# Altium project Speaker.PrjPcb
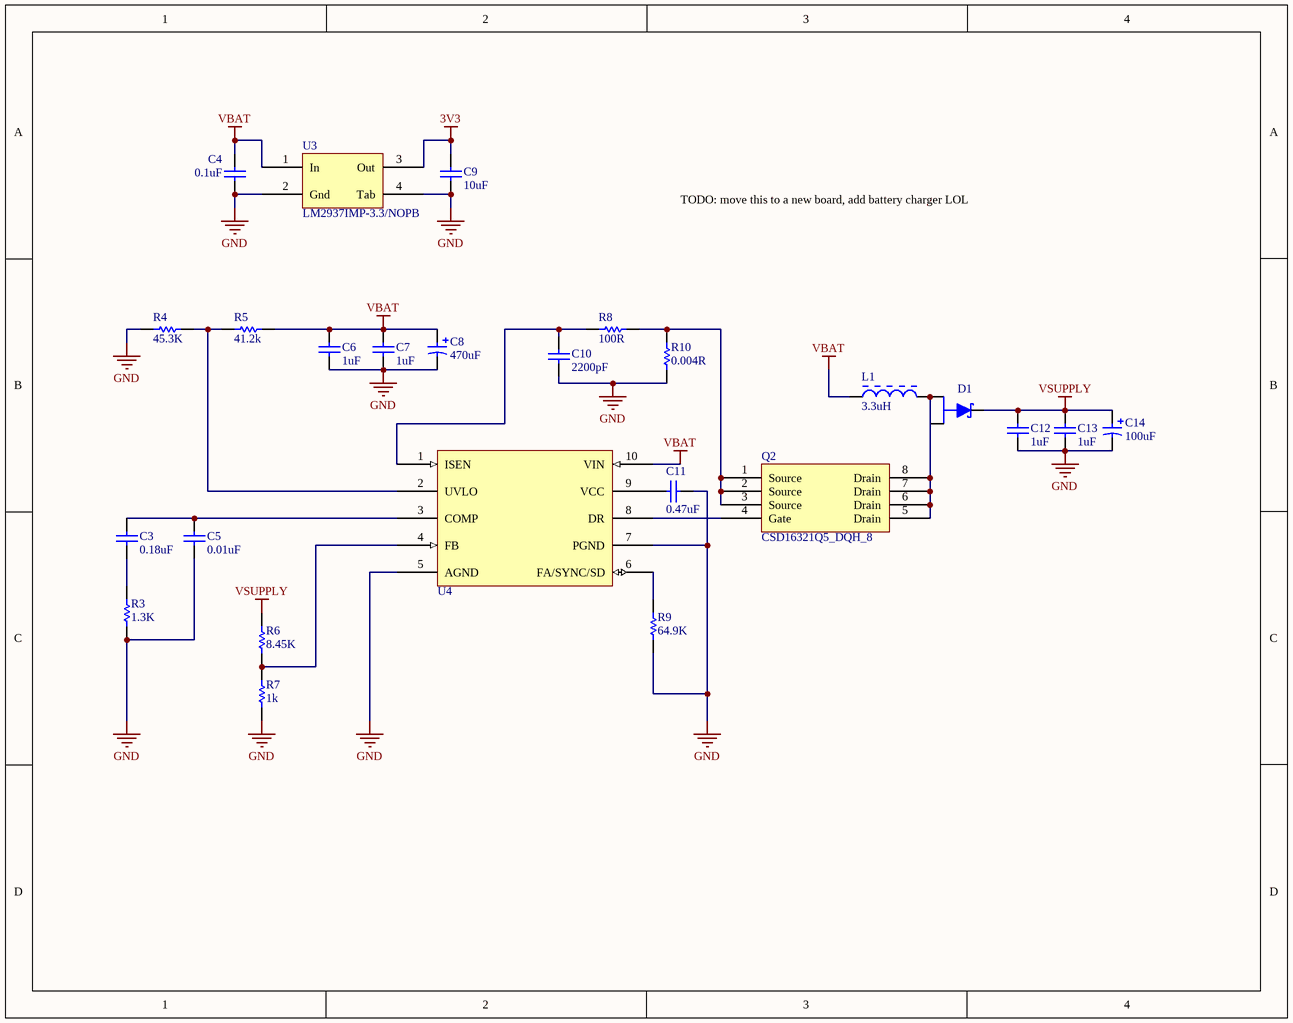
[diagram p0: Power_Supply.SchDoc]
6 sheets, 167 parts. Net scope: global (net labels, ports and power ports of the same name join across sheets).
Board file: Amplifier_Board.PcbDoc
Sheets:
  Power_Supply.SchDoc
  ICs.SchDoc
  Input_Section.SchDoc
  Power_Section.SchDoc
  Filter_Section.SchDoc
  Connectors.SchDoc

## Sheet Power_Supply.SchDoc: Power Supply
size A; Author: Yifei Li; DocumentNumber: 1; SheetNumber: 1; SheetTotal: 6

### Parts
C3  0.18uF  [CAPC1608X09N]
C4  0.1uF  [CAPC1608X09N]
C5  0.01uF  [CAPC1608X09N]
C6  1uF  [CAPC1608X09N]
C7  1uF  [CAPC1608X09N]
C8  470uF  [NICHICON 8x10 CAP]
C9  10uF  [CAPC3216X18N]
C10  2200pF  [CAPC1608X09N]
C11  0.47uF  [CAPC1608X09N]
C12  1uF  [CAPC1608X09N]
C13  1uF  [CAPC1608X09N]
C14  100uF  [PCAP_8x10-ELEC00]
D1  (no value)  [ONSEMI DPAK-3]
L1  3.3uH  [IND_BOURNS_SRP00 - duplicate]
Q2  CSD16321Q5_DQH_8  [DQH8]
R3  1.3K  [RESC1608X06N]
R4  45.3K  [RESC1608X06N]
R5  41.2k  [RESC1608X06N]
R6  8.45K  [RESC1608X06N]
R7  1k  [RESC1608X06N]
R8  100R  [RESC1608X06N]
R9  64.9K  [RESC1608X06N]
R10  0.004R  [RESC6533X09N]
U3  LM2937IMP-3.3/NOPB  [DSO-G3/C6.4]
U4  LM3481  [VSSOP10]  (value not drawn)

### Nets
3V3: C9.2 U3.3(Out)
GND: C4.1 C5.1 C6.1 C7.1 C8.2 C9.1 C10.1 C11.2 C12.1 C13.1 C14.2 R3.1 R4.1 R7.1 R9.1 R10.1 U3.2(Gnd) U3.4(Tab) U4.5(AGND) U4.7(PGND)
VBAT: C4.2 C6.2 C7.2 C8.1 L1.1 R5.2 U3.1(In) U4.10(VIN)
VSUPPLY: C12.2 C13.2 C14.1 D1.4 R6.1
NetC3_1: C3.1 R3.2
NetC3_2: C3.2 C5.2 U4.3(COMP)
NetC10_2: C10.2 R8.1 U4.1(ISEN)
NetC11_1: C11.1 U4.9(VCC)
NetD1_1: D1.1 L1.2 Q2.5(Drain) Q2.6(Drain) Q2.7(Drain) Q2.8(Drain)
NetQ2_1: Q2.1(Source) Q2.2(Source) Q2.3(Source) R8.2 R10.2
NetQ2_4: Q2.4(Gate) U4.8(DR)
NetR4_2: R4.2 R5.1 U4.2(UVLO)
NetR6_2: R6.2 R7.2 U4.4(FB)
NetR9_2: R9.2 U4.6(FA/SYNC/SD)

Not connected (* = marked no-connect by the designer): D1 3

### Notes on the sheet
- TODO: move this to a new board, add battery charger LOL

### Library data of the parts
C3 = CAP CER 0.18uF 0603: Manufacturer: Murata; Voltage: 25V; Rating: X7R; Value: 0.18uF; Digikey Part Number: 490-6431-1-ND; Package: 0603
C4 = CAP CER 0.1uF 0603: Voltage: 100V; Rating: X7R; Tolerance: 10%; Value: 0.1uF; Digikey Part Number: 490-3285-1-ND; Package: 0603
C5 = CAP CER 0.01uF 0603: Manufacturer: Murata; Rating: C0G; Value: 0.01uF; Digikey Part Number: 490-9666-1-ND
C6 C7 C12 C13 = CAP CER 1uF 0603: Voltage: 35V; Value: 1uF; Digikey Part Number: 490-10487-1-ND
C8 = CAP ALUM 470uF SMD: Digikey Part Number: 493-2181-1-ND; Value: 470uF
C9 = CAP CER 10uF 1206: 3V3 filter cap; Voltage: 25V; Rating: X7R; Value: 10uF; Digikey Part Number: 490-6518-1-ND
C10 = CAP CER 2200pF 0603: Manufacturer: Murata; Voltage: 50V; Tolerance: 1%; Rating: C0G; Value: 2200pF; Digikey Part Number: 490-7768-1-ND
C11 = CAP CER 0.47uF 0603: Voltage: 25V; Rating: X7R; Value: 0.47uF; Digikey Part Number: 490-3291-1-ND
C14 = CAP ALUM 100uF SMD: Manufacturer: Nichicon; Voltage: 50V; Digikey Part Number: 493-2226-1-ND; Value: 100uF
D1 = MBRD835LT4G: SHOTTKEY 35V 8A; Type: SCHOT; Configuration: Single; Footprint: TO-252-3; Voltage: 35V; Current: 8A; Digikey Part Number: MBRD835LT4GOSCT-ND
L1 = IND 3.3µH 7A SMD: Digikey Part Number: SRP7030-3R3FMCT-ND; Value: 3.3uH
Q2 = CSD16321Q5_DQH_8: Manufacturer: Texas Instruments; INDUSTRY_STD_PKG_TYPE: SON; FAMILY_NAME: N-Channel MOSFET Transistors; PIN_COUNT: 8; PACKAGE_DESIGNATOR: DQH; Type: DEV; Datasheet URL: http://www.ti.com/lit/gpn/CSD16321Q5; GENERIC_PART_NUMBER: CSD16321Q5; RefDes: RefDes; Value: Value; Digikey Part Number: 296-25643-1-ND
R3 = RES 1.3K 0603: Manufacturer: Vishay Dale; Tolerance: 1%; Power: 0.1W; Type: RES; Footprint: 0603; Digikey Part Number: 541-1.30KHCT-ND; Value: 1.3K
R4 = RES 45.3K 0603: Manufacturer: Vishay Dale; Tolerance: 1%; Power: 0.1W; Type: RES; Footprint: 0603; Digikey Part Number: 541-45.3KHCT-ND; Value: 45.3K
R5 = RES 41.2K 0603: Manufacturer: Vishay Dale; Tolerance: 1%; Power: 0.1W; Type: RES; Footprint: 0603; Digikey Part Number: 311-41.2KHRCT-ND; Value: 41.2k
R6 = RES 8.45K 0603: Manufacturer: Vishay Dale; Tolerance: 1%; Power: 0.1W; Type: RES; Footprint: 0603; Digikey Part Number: 541-8.45KHCT-ND; Value: 8.45K
R7 = RES 1K 0603: Manufacturer: Panasonic; Manufacturer Part Number: ERJ-PA3F1001V; Tolerance: 1%; Power: 0.25W; Type: RES; Footprint: 0603; Temperature: 155dC; Digikey Part Number: P1.0KBYCT-ND; Value: 1k
R8 = RES 100R 0603: Tolerance: 1%; Power: 0.25W; Type: RES; Footprint: 0603; Digikey Part Number: 541-100SACT-ND; Value: 100R
R9 = RES 64.9K 0603: Manufacturer: Vishay Dale; Tolerance: 1%; Power: 0.1W; Type: RES; Footprint: 0603; Digikey Part Number: 541-64.9KHCT-ND; Value: 64.9K
R10 = RES 0.004R 2512: Manufacturer: Panasonic; Tolerance: 1%; Power: 1W; Type: RES; Footprint: 2512; Digikey Part Number: P4.0MCT-ND; Value: 0.004R
U4 = LM3481: IC REG CTRLR MULT TOP 10MSOP; Digikey Part Number: LM3481MM/NOPBCT-ND
U3 = LM2937IMP-3.3/NOPB: Digikey Part Number: LM2937IMP-3.3/NOPBCT-ND

## Sheet ICs.SchDoc
size A4; DocumentNumber: 2; SheetNumber: 2; SheetTotal: 6
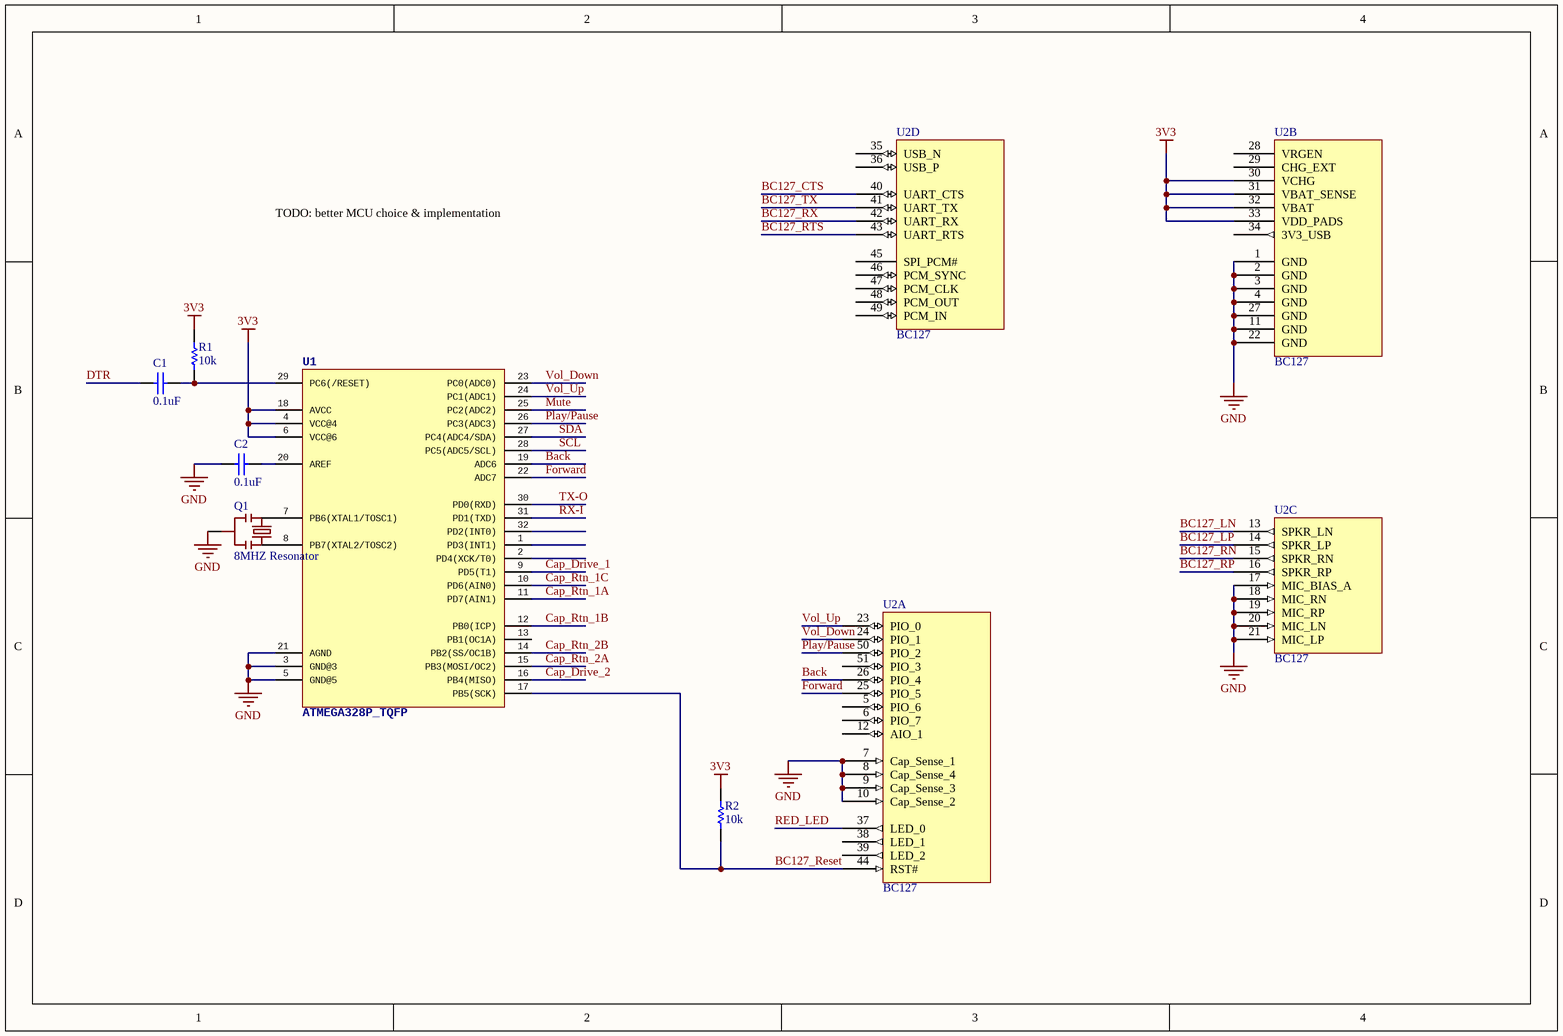
[diagram p1: ICs.SchDoc]

### Parts
C1  0.1uF  [CAPC1608X09N]
C2  0.1uF  [CAPC1608X09N]
Q1  8MHZ Resonator  [MURATA CSTCE8M00G52Z-R0]
R1  10k  [RESC1608X06N]
R2  10k  [RESC1608X06N]
U1  ATMEGA328P_TQFP  [TQFP32-08]
U2  BC127  [BC127 - No Keepout]  (parts A,B,C,D of 4)

### Nets
3V3: R1.2 R2.2 U1.4(VCC@4) U1.6(VCC@6) U1.18(AVCC) U2.30(VCHG) U2.31(VBAT_SENSE) U2.32(VBAT) U2.33(VDD_PADS)
GND: C2.1 Q1.2(GND) U1.3(GND@3) U1.5(GND@5) U1.21(AGND) U2.1(GND) U2.2(GND) U2.3(GND) U2.4(GND) U2.7(Cap_Sense_1) U2.8(Cap_Sense_4) U2.9(Cap_Sense_3) U2.10(Cap_Sense_2) U2.11(GND) U2.17(MIC_BIAS_A) U2.18(MIC_RN) U2.19(MIC_RP) U2.20(MIC_LN) U2.21(MIC_LP) U2.22(GND) U2.27(GND)
Back: U1.19(ADC6) U2.26(PIO_4)
BC127_CTS: U2.40(UART_CTS)
BC127_LN: U2.13(SPKR_LN)
BC127_LP: U2.14(SPKR_LP)
BC127_Reset: R2.1 U1.17(PB5(SCK)) U2.44(RST#)
BC127_RN: U2.15(SPKR_RN)
BC127_RP: U2.16(SPKR_RP)
BC127_RTS: U2.43(UART_RTS)
BC127_RX: U2.42(UART_RX)
BC127_TX: U2.41(UART_TX)
Cap_Drive_1: U1.9(PD5(T1))
Cap_Drive_2: U1.16(PB4(MISO))
Cap_Rtn_1A: U1.11(PD7(AIN1))
Cap_Rtn_1B: U1.12(PB0(ICP))
Cap_Rtn_1C: U1.10(PD6(AIN0))
Cap_Rtn_2A: U1.15(PB3(MOSI/OC2))
Cap_Rtn_2B: U1.14(PB2(SS/OC1B))
DTR: C1.1
Forward: U1.22(ADC7) U2.25(PIO_5)
Mute: U1.25(PC2(ADC2))
Play/Pause: U1.26(PC3(ADC3)) U2.50(PIO_2)
RED_LED: U2.37(LED_0)
RX-I: U1.31(PD1(TXD))
SCL: U1.28(PC5(ADC5/SCL))
SDA: U1.27(PC4(ADC4/SDA))
TX-O: U1.30(PD0(RXD))
Vol_Down: U1.23(PC0(ADC0)) U2.24(PIO_1)
Vol_Up: U1.24(PC1(ADC1)) U2.23(PIO_0)
NetC1_2: C1.2 R1.1 U1.29(PC6(/RESET))
NetC2_2: C2.2 U1.20(AREF)
NetQ1_1: Q1.1 U1.7(PB6(XTAL1/TOSC1))
NetQ1_3: Q1.3 U1.8(PB7(XTAL2/TOSC2))

Not connected (* = marked no-connect by the designer): U1 1(PD3(INT1)) 2(PD4(XCK/T0)) 13(PB1(OC1A)) 32(PD2(INT0)); U2 5(PIO_6) 6(PIO_7) 12(AIO_1) 28(VRGEN) 29(CHG_EXT) 34(3V3_USB) 35(USB_N) 36(USB_P) 38(LED_1) 39(LED_2) 45(SPI_PCM#) 46(PCM_SYNC) 47(PCM_CLK) 48(PCM_OUT) 49(PCM_IN) 51(PIO_3)

### Notes on the sheet
- TODO: better MCU choice & implementation

### Library data of the parts
C1 C2 = CAP CER 0.1uF 0603: as C4 on sheet Power_Supply; Value: 0.1uF; Digikey Part Number: 490-3285-1-ND; Package: 0603
Q1 = RESONATOR 8MHZ: Digikey Part Number: 490-5995-1-ND
R1 R2 = RES 10K 0603: Manufacturer: Yageo; Manufacturer Part Number: RC0603FR-0710KL; Tolerance: 1%; Power: 0.1W; Type: RES; Footprint: 0603; Temperature: 155dC; Digikey Part Number: 311-10.0KHRCT-ND; Value: 10k
U1 = ATMEGA328P_TQFP: PROD_ID: IC-09069; Digikey Part Number: ATMEGA328P-AURCT-ND

## Sheet Input_Section.SchDoc
size A4; DocumentNumber: 3; SheetNumber: 3; SheetTotal: 6
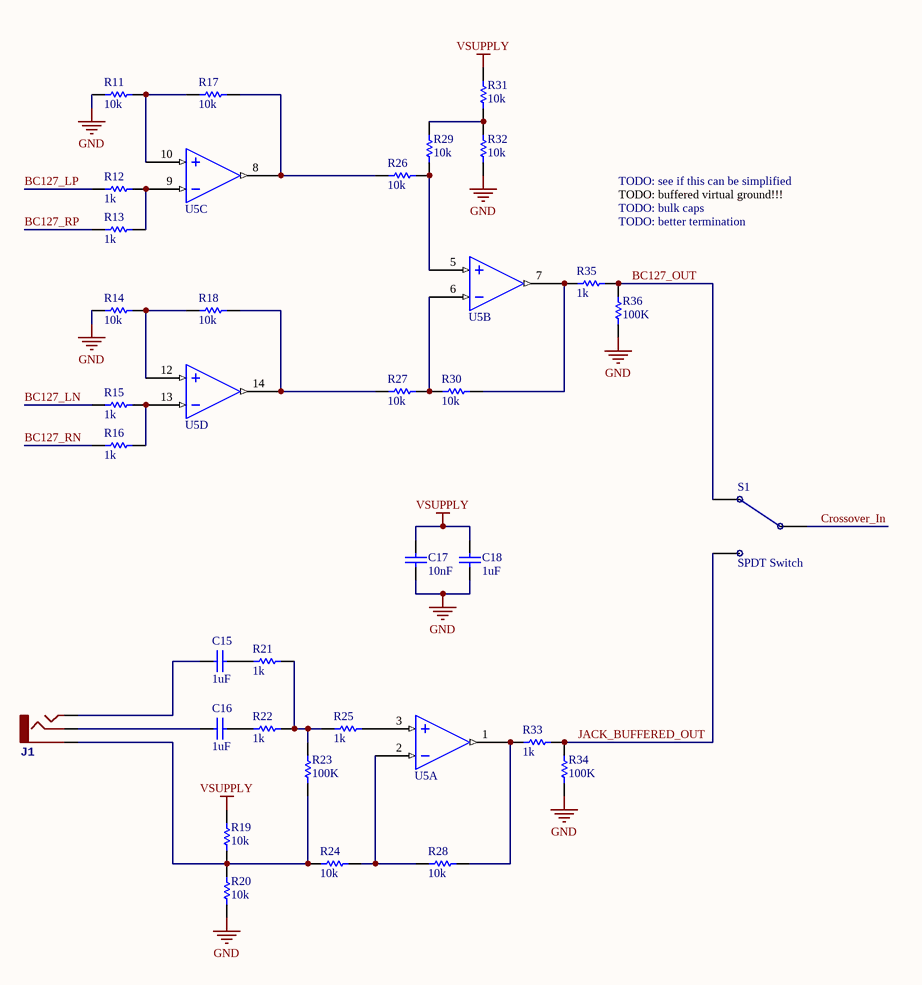
[diagram p2: Input_Section.SchDoc]

### Parts
C15  1uF  [CAP Radial 5mm]
C16  1uF  [CAP Radial 5mm]
C17  10nF  [CAPC1608X09N]
C18  1uF  [CAPC1608X09N]
J1  3.5mm Audio Jack  [70543-0002]  (value not drawn)
R11  10k  [RESC1608X06N]
R12  1k  [RESC1608X06N]
R13  1k  [RESC1608X06N]
R14  10k  [RESC1608X06N]
R15  1k  [RESC1608X06N]
R16  1k  [RESC1608X06N]
R17  10k  [RESC1608X06N]
R18  10k  [RESC1608X06N]
R19  10k  [RESC1608X06N]
R20  10k  [RESC1608X06N]
R21  1k  [RESC1608X06N]
R22  1k  [RESC1608X06N]
R23  100K  [RESC1608X06N]
R24  10k  [RESC1608X06N]
R25  1k  [RESC1608X06N]
R26  10k  [RESC1608X06N]
R27  10k  [RESC1608X06N]
R28  10k  [RESC1608X06N]
R29  10k  [RESC1608X06N]
R30  10k  [RESC1608X06N]
R31  10k  [RESC1608X06N]
R32  10k  [RESC1608X06N]
R33  1k  [RESC1608X06N]
R34  100K  [RESC1608X06N]
R35  1k  [RESC1608X06N]
R36  100K  [RESC1608X06N]
S1  SPDT Switch  [70543-0002]
U5  OPA4134UA  [SOIC127P600X175-14N]  (value not drawn)  (parts A,B,C,D of 4)

### Nets
GND: C17.1 C18.2 R11.1 R14.1 R20.1 R32.1 R34.1 R36.1 U5.11(V-)
VSUPPLY: C17.2 C18.1 R19.2 R31.2 U5.4(V+)
BC127_LN: R15.1
BC127_LP: R12.1
BC127_OUT: R35.2 R36.2 S1.2
BC127_RN: R16.1
BC127_RP: R13.1
Crossover_In: S1.1
JACK_BUFFERED_OUT: R33.2 R34.2 S1.3
NetC15_1: C15.1 J1.3(LEFT)
NetC15_2: C15.2 R21.1
NetC16_1: C16.1 J1.2(RIGHT)
NetC16_2: C16.2 R22.1
NetJ1_1: J1.1(SLEEVE) R19.1 R20.2 R23.1 R24.1
NetR11_2: R11.2 R17.1 U5.10(+In_C)
NetR12_2: R12.2 R13.2 U5.9(-In_C)
NetR14_2: R14.2 R18.1 U5.12(+In_D)
NetR15_2: R15.2 R16.2 U5.13(-In_D)
NetR17_2: R17.2 R26.1 U5.8(Out_C)
NetR18_2: R18.2 R27.1 U5.14(Out_D)
NetR21_2: R21.2 R22.2 R23.2 R25.1
NetR24_2: R24.2 R28.1 U5.2(-In_A)
NetR25_2: R25.2 U5.3(+In_A)
NetR26_2: R26.2 R29.1 U5.5(+In_B)
NetR27_2: R27.2 R30.2 U5.6(-In_B)
NetR28_2: R28.2 R33.1 U5.1(Out_A)
NetR29_2: R29.2 R31.1 R32.2
NetR30_1: R30.1 R35.1 U5.7(Out_B)

### Notes on the sheet
- TODO: see if this can be simplified
- TODO: buffered virtual ground!!!
- TODO: bulk caps
- TODO: better termination

### Library data of the parts
C15 C16 = CAP 1uF Radial 5mm: Audio coupling cap; Manufacturer: EPCOS (TDK); Manufacturer P/N: B32529C105J; Voltage: 63V; Value: 1uF; Digikey Part Number: 495-1119-ND
C17 = CAP CER 10nF 0603: Bypass caps; Manufacturer: Murata; Value: 10nF; Digikey Part Number: 490-9666-1-ND
C18 = CAP CER 1uF 0603: Voltage: 35V; Value: 1uF; Digikey Part Number: 490-10487-1-ND
R11 R14 R17-R20 R24 R26-R32 = RES 10K 0603: as R1 on sheet ICs; Type: RES; Footprint: 0603; Temperature: 155dC; Digikey Part Number: 311-10.0KHRCT-ND; Value: 10k
R12 R13 R15 R16 R21 R22 R25 R33 R35 = RES 1K 0603: as R7 on sheet Power_Supply; Type: RES; Footprint: 0603; Temperature: 155dC; Digikey Part Number: P1.0KBYCT-ND; Value: 1k
R23 R34 R36 = RES 100K 0603: Tolerance: 1%; Power: 0.1W; Footprint: 0603; Value: 100K; Digikey Part Number: 311-100KHRCT-ND
U5 = OPA4134UA: Quad OPAx134 Operational Amplifier; Digikey Part Number: 296-26284-1-ND

## Sheet Power_Section.SchDoc
size A4; DocumentNumber: 4; SheetNumber: 4; SheetTotal: 6
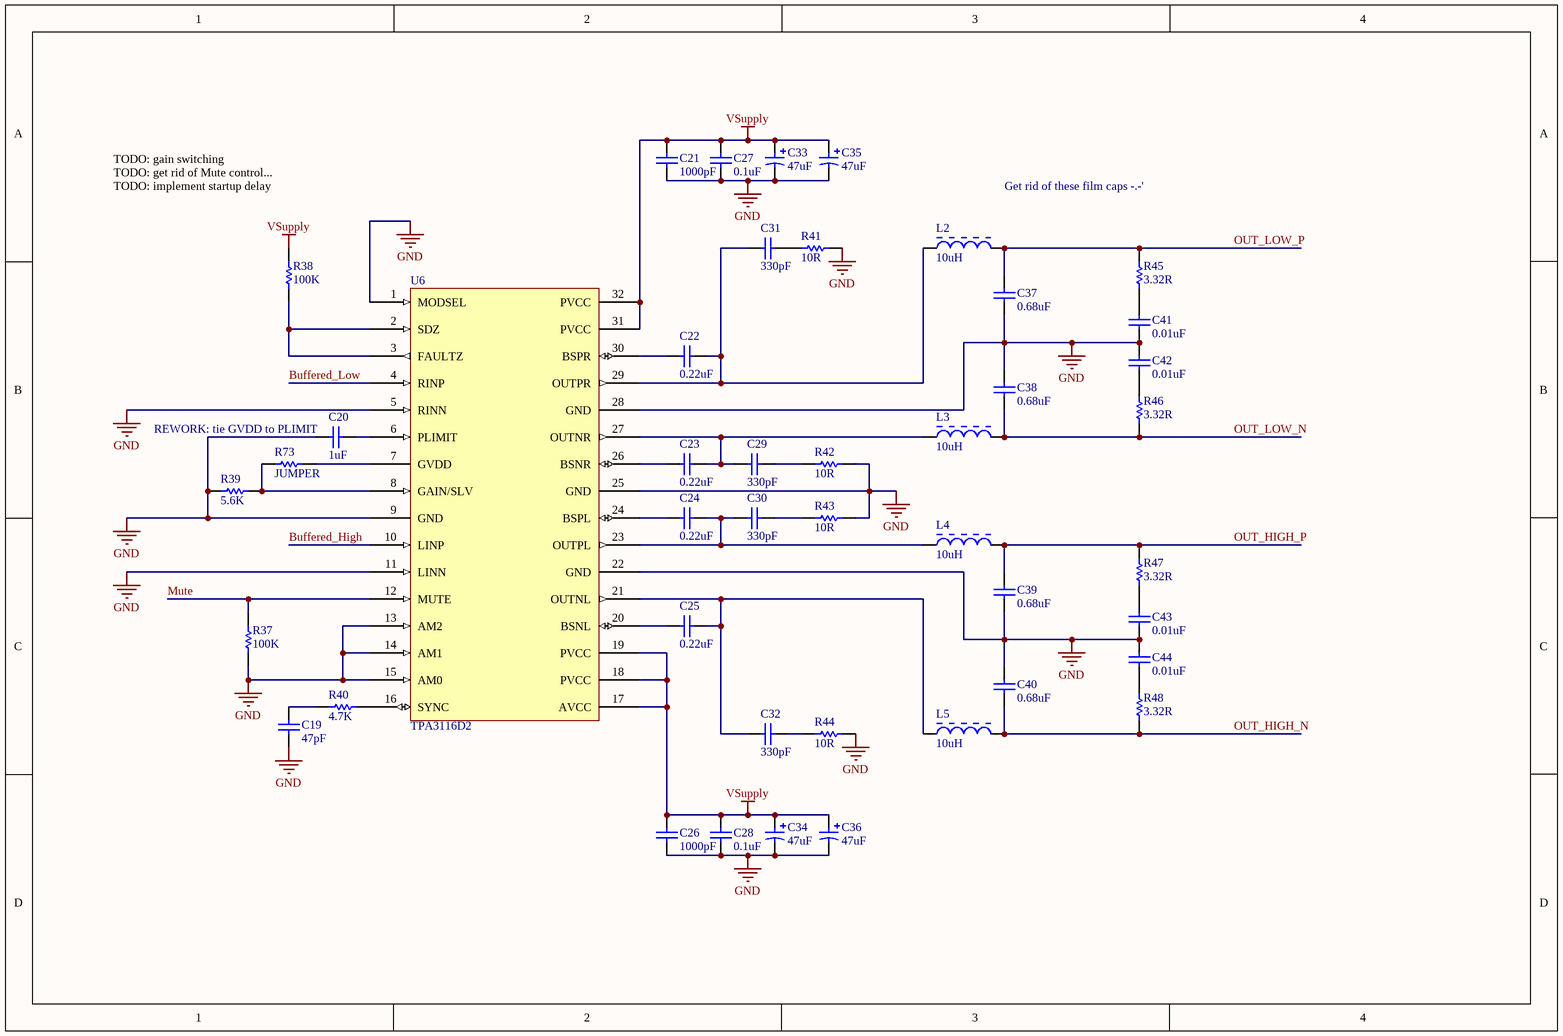
[diagram p3: Power_Section.SchDoc]

### Parts
C19  47pF  [CAPC1608X09N]
C20  1uF  [CAPC1608X09N]
C21  1000pF  [CAPC1608X09N]
C22  0.22uF  [CAPC1608X09N]
C23  0.22uF  [CAPC1608X09N]
C24  0.22uF  [CAPC1608X09N]
C25  0.22uF  [CAPC1608X09N]
C26  1000pF  [CAPC1608X09N]
C27  0.1uF  [CAPC1608X09N]
C28  0.1uF  [CAPC1608X09N]
C29  330pF  [CAPC1608X09N]
C30  330pF  [CAPC1608X09N]
C31  330pF  [CAPC1608X09N]
C32  330pF  [CAPC1608X09N]
C33  47uF  [CAP_EEFK_D]
C34  47uF  [CAP_EEFK_D]
C35  47uF  [CAP_EEFK_D]
C36  47uF  [CAP_EEFK_D]
C37  0.68uF  [CAP Radial 5mm]
C38  0.68uF  [CAP Radial 5mm]
C39  0.68uF  [CAP Radial 5mm]
C40  0.68uF  [CAP Radial 5mm]
C41  0.01uF  [CAPC1608X09N]
C42  0.01uF  [CAPC1608X09N]
C43  0.01uF  [CAPC1608X09N]
C44  0.01uF  [CAPC1608X09N]
L2  10uH  [IND_BOURNS_SRN10]
L3  10uH  [IND_BOURNS_SRN10]
L4  10uH  [IND_BOURNS_SRN10]
L5  10uH  [IND_BOURNS_SRN10]
R37  100K  [RESC1608X06N]
R38  100K  [RESC1608X06N]
R39  5.6K  [RESC1608X06N]
R40  4.7K  [RESC1608X06N]
R41  10R  [RESC2012X06N]
R42  10R  [RESC2012X06N]
R43  10R  [RESC2012X06N]
R44  10R  [RESC2012X06N]
R45  3.32R  [RESC1608X06N]
R46  3.32R  [RESC1608X06N]
R47  3.32R  [RESC1608X06N]
R48  3.32R  [RESC1608X06N]
R73  JUMPER  [RESC1608X06N]
U6  TPA3116D2  [DAP0032A]

### Nets
GND: C19.1 C20.1 C21.1 C26.1 C27.1 C28.1 C33.2 C34.2 C35.2 C36.2 C37.1 C38.2 C39.1 C40.2 C41.1 C42.2 C43.1 C44.2 R37.1 R39.2 R41.2 R42.2 R43.2 R44.2 U6.1(MODSEL) U6.5(RINN) U6.9(GND) U6.11(LINN) U6.13(AM2) U6.14(AM1) U6.15(AM0) U6.22(GND) U6.25(GND) U6.28(GND) U6.33(POWERPAD)
VSUPPLY: C21.2 C26.2 C27.2 C28.2 C33.1 C34.1 C35.1 C36.1 R38.2 U6.17(AVCC) U6.18(PVCC) U6.19(PVCC) U6.31(PVCC) U6.32(PVCC)
Buffered_High: U6.10(LINP)
Buffered_Low: U6.4(RINP)
Mute: R37.2 U6.12(MUTE)
OUT_HIGH_N: C40.1 L5.2 R48.1
OUT_HIGH_P: C39.2 L4.2 R47.2
OUT_LOW_N: C38.1 L3.2 R46.1
OUT_LOW_P: C37.2 L2.2 R45.2
NetC19_2: C19.2 R40.1
NetC20_2: C20.2 U6.6(PLIMIT)
NetC22_1: C22.1 U6.30(BSPR)
NetC22_2: C22.2 C31.1 L2.1 U6.29(OUTPR)
NetC23_1: C23.1 U6.26(BSNR)
NetC23_2: C23.2 C29.1 L3.1 U6.27(OUTNR)
NetC24_1: C24.1 U6.24(BSPL)
NetC24_2: C24.2 C30.1 L4.1 U6.23(OUTPL)
NetC25_1: C25.1 U6.20(BSNL)
NetC25_2: C25.2 C32.1 L5.1 U6.21(OUTNL)
NetC29_2: C29.2 R42.1
NetC30_2: C30.2 R43.1
NetC31_2: C31.2 R41.1
NetC32_2: C32.2 R44.1
NetC41_2: C41.2 R45.1
NetC42_1: C42.1 R46.2
NetC43_2: C43.2 R47.1
NetC44_1: C44.1 R48.2
NetR38_1: R38.1 U6.2(SDZ) U6.3(FAULTZ)
NetR39_1: R39.1 R73.1 U6.8(GAIN/SLV)
NetR40_2: R40.2 U6.16(SYNC)
NetR73_2: R73.2 U6.7(GVDD)

### Notes on the sheet
- TODO: gain switching
- TODO: get rid of Mute control...
- TODO: implement startup delay
- Get rid of these film caps -.-'
- REWORK: tie GVDD to PLIMIT

### Library data of the parts
C19 = CAP CER 47pF 0603: Rating: C0G; Voltage: 50V; Value: 47pF; Digikey Part Number: 490-1419-1-ND
C20 = CAP CER 1uF 0603: Voltage: 35V; Value: 1uF; Digikey Part Number: 490-10487-1-ND
C21 C26 = CAP CER 1000pF 0603: Manufacturer: Murata; Rating: C0G; Voltage: 50V; Value: 1000pF; Digikey Part Number: 490-1451-1-ND
C22-C25 = CAP CER 0.22uF 0603: Manufacturer: Murata; Voltage: 50V; Rating: X7R; Value: 0.22uF; Digikey Part Number: 490-5402-1-ND
C27 C28 = CAP CER 0.1uF 0603: as C4 on sheet Power_Supply; Value: 0.1uF; Digikey Part Number: 490-3285-1-ND; Package: 0603
C29-C32 = CAP CER 330pF 0603: Manufacturer: Murata; Rating: C0G; Voltage: 50V; Value: 330pF; Digikey Part Number: 490-1439-1-ND
C33-C36 = CAP ALUM 47uF SMD: Manufacturer: Panasonic; Voltage: 35V; Digikey Part Number: PCE3842CT-ND; Value: 47uF
C37-C40 = CAP 0.68uF Radial 5mm: Output Cap; Manufacturer: EPCOS (TDK); Voltage: 63V; Value: 0.68uF; Digikey Part Number: 495-1114-ND
C41-C44 = CAP CER 0.01uF 0603: Manufacturer: Murata; Rating: C0G; Value: 0.01uF; Digikey Part Number: 490-9666-1-ND
L2-L5 = IND 10uH 5A SMD: Digikey Part Number: SRN1060-100MCT-ND; Value: 10uH
R37 R38 = RES 100K 0603: Tolerance: 1%; Power: 0.1W; Footprint: 0603; Value: 100K; Digikey Part Number: 311-100KHRCT-ND
R39 = RES 5.6K 0603: Tolerance: 1%; Type: RES; Footprint: 0603; Value: 5.6K; Digikey Part Number: 311-5.60KHRCT-ND
R40 = RES 4.7K 0603: Tolerance: 1%; Type: RES; Footprint: 0603; Value: 4.7K; Digikey Part Number: 311-4.70KHRCT-ND
R41-R44 = RES 10R 0805: Tolerance: 1%; Power: 0.25W; Type: RES; Footprint: 0805; Digikey Part Number: RNCP0805FTD10R0CT-ND; Value: 10R
R45-R48 = RES 3.32R 0603: Tolerance: 1%; Power: 0.1W; Type: RES; Footprint: 0603; Digikey Part Number: 311-3.32HRCT-ND; Value: 3.32R
R73 = RES JUMPER 0603: Tolerance: 1%; Power: 0.25W; Type: RES; Footprint: 0603; Temperature: 155dC; Value: JUMPER; Digikey Part Number: 311-0.0GRCT-ND
U6 = TPA3116D2: Digikey Part Number: 296-39337-1-ND

## Sheet Filter_Section.SchDoc
size A3; DocumentNumber: 5; SheetNumber: 5; SheetTotal: 6
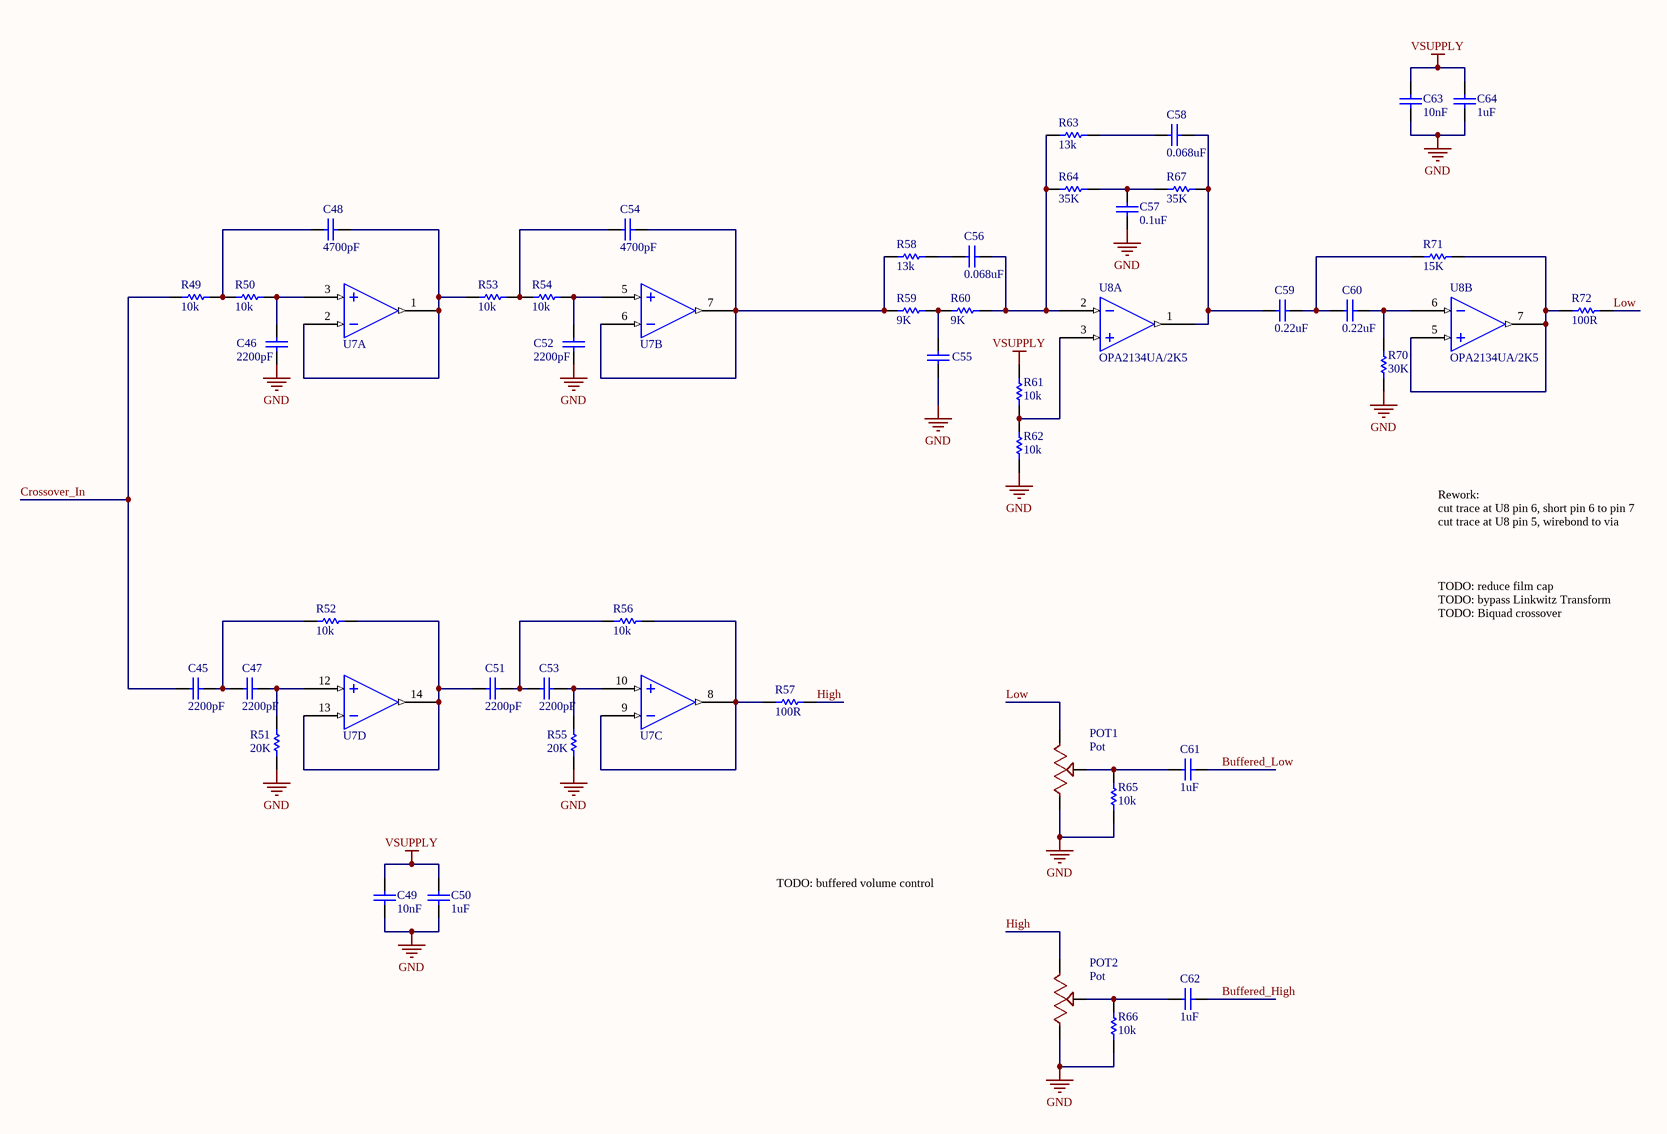
[diagram p4: Filter_Section.SchDoc]

### Parts
C45  2200pF  [CAPC1608X09N]
C46  2200pF  [CAPC1608X09N]
C47  2200pF  [CAPC1608X09N]
C48  4700pF  [CAPC1608X09N]
C49  10nF  [CAPC1608X09N]
C50  1uF  [CAPC1608X09N]
C51  2200pF  [CAPC1608X09N]
C52  2200pF  [CAPC1608X09N]
C53  2200pF  [CAPC1608X09N]
C54  4700pF  [CAPC1608X09N]
C55  0.39uF  [CAP Radial 5mm]  (value not drawn)
C56  0.068uF  [CAPC3216X18N]
C57  0.1uF  [CAPC3216X18N]
C58  0.068uF  [CAPC3216X18N]
C59  0.22uF  [CAP Radial 5mm]
C60  0.22uF  [CAP Radial 5mm]
C61  1uF  [CAP Radial 5mm]
C62  1uF  [CAP Radial 5mm]
C63  10nF  [CAPC1608X09N]
C64  1uF  [CAPC1608X09N]
POT1  Pot  [70543-0002]
POT2  Pot  [70543-0002]
R49  10k  [RESC1608X06N]
R50  10k  [RESC1608X06N]
R51  20K  [RESC1608X06N]
R52  10k  [RESC1608X06N]
R53  10k  [RESC1608X06N]
R54  10k  [RESC1608X06N]
R55  20K  [RESC1608X06N]
R56  10k  [RESC1608X06N]
R57  100R  [RESC1608X06N]
R58  13k  [RESC1608X06N]
R59  9K  [RESC1608X06N]
R60  9K  [RESC1608X06N]
R61  10k  [RESC1608X06N]
R62  10k  [RESC1608X06N]
R63  13k  [RESC1608X06N]
R64  35K  [RESC1608X06N]
R65  10k  [RESC1608X06N]
R66  10k  [RESC1608X06N]
R67  35K  [RESC1608X06N]
R70  30K  [RESC1608X06N]
R71  15K  [RESC1608X06N]
R72  100R  [RESC1608X06N]
U7  OPA4134UA  [SOIC127P600X175-14N]  (value not drawn)  (parts A,B,C,D of 4)
U8  OPA2134UA/2K5  [SOIC127P600X175-8N]  (parts A,B of 2)

### Nets
GND: C46.1 C49.1 C50.1 C52.1 C55.1 C57.2 C63.1 C64.1 POT1.3(B) POT2.3(B) R51.1 R55.2 R62.1 R65.1 R66.1 R70.1 U7.11(V-) U8.4(V-)
VSUPPLY: C49.2 C50.2 C63.2 C64.2 R61.2 U7.4(V+) U8.8(V+)
Buffered_High: C62.2
Buffered_Low: C61.2
Crossover_In: C45.1 R49.1
High: POT2.1(A) R57.2
Low: POT1.1(A) R72.2
NetC45_2: C45.2 C47.1 R52.1
NetC46_2: C46.2 R50.2 U7.3(+In_A)
NetC47_2: C47.2 R51.2 U7.12(+In_D)
NetC48_1: C48.1 R49.2 R50.1
NetC48_2: C48.2 R53.1 U7.1(Out_A) U7.2(-In_A)
NetC51_1: C51.1 R52.2 U7.13(-In_D) U7.14(Out_D)
NetC51_2: C51.2 C53.1 R56.1
NetC52_2: C52.2 R54.2 U7.5(+In_B)
NetC53_2: C53.2 R55.1 U7.10(+In_C)
NetC54_1: C54.1 R53.2 R54.1
NetC54_2: C54.2 R58.1 R59.1 U7.6(-In_B) U7.7(Out_B)
NetC55_2: C55.2 R59.2 R60.1
NetC56_1: C56.1 R58.2
NetC56_2: C56.2 R60.2 R63.1 R64.1 U8.2(-In_A)
NetC57_1: C57.1 R64.2 R67.1
NetC58_1: C58.1 R63.2
NetC58_2: C58.2 C59.1 R67.2 U8.1(Out_A)
NetC59_2: C59.2 C60.1 R71.1
NetC60_2: C60.2 R70.2 U8.6(-In_B)
NetC61_1: C61.1 POT1.2(W) R65.2
NetC62_1: C62.1 POT2.2(W) R66.2
NetR56_2: R56.2 R57.1 U7.8(Out_C) U7.9(-In_C)
NetR61_1: R61.1 R62.2 U8.3(+In_A)
NetR71_2: R71.2 R72.1 U8.5(+In_B) U8.7(Out_B)

### Notes on the sheet
- Rework:
  cut trace at U8 pin 6, short pin 6 to pin 7
  cut trace at U8 pin 5, wirebond to via
- TODO: reduce film cap
- TODO: bypass Linkwitz Transform
- TODO: Biquad crossover
- TODO: buffered volume control

### Library data of the parts
C45-C47 C51-C53 = CAP CER 2200pF 0603: as C10 on sheet Power_Supply; Value: 2200pF; Digikey Part Number: 490-7768-1-ND
C48 C54 = CAP CER 4700pF 0603: Manufacturer: TDK; Voltage: 100V; Tolerance: 5%; Rating: C0G; Value: 4700pF; Digikey Part Number: 445-172684-1-ND
C49 C63 = CAP CER 10nF 0603: Bypass caps; Manufacturer: Murata; Value: 10nF; Digikey Part Number: 490-9666-1-ND
C50 C64 = CAP CER 1uF 0603: Voltage: 35V; Value: 1uF; Digikey Part Number: 490-10487-1-ND
C55 = CAP 0.39uF Radial 5mm: Film cap in LT; Manufacturer: EPCOS (TDK); Manufacturer P/N: B32529C105J; Voltage: 63V; Value: 0.39uF; Digikey Part Number: 495-4846-1-ND
C56 C58 = CAP CER 0.068uF 1206: Voltage: 100V; Rating: C0G; Tolerance: 5%; Value: 0.068uF; Digikey Part Number: 445-172693-1-ND; Package: 1206
C57 = CAP CER 0.1uF 1206: LT capacitor; Voltage: 100V; Rating: C0G; Tolerance: 5%; Value: 0.1uF; Digikey Part Number: 445-172694-1-ND; Package: 1206
C59 C60 = CAP 0.22uF Radial 5mm: Film cap in crossover; Manufacturer: EPCOS (TDK); Voltage: 100V; Value: 0.22uF; Digikey Part Number: 495-4985-1-ND
C61 C62 = CAP 1uF Radial 5mm: as C15 on sheet Input_Section; Value: 1uF; Digikey Part Number: 495-1119-ND
R49 R50 R52-R54 R56 R61 R62 R65 R66 = RES 10K 0603: as R1 on sheet ICs; Type: RES; Footprint: 0603; Temperature: 155dC; Digikey Part Number: 311-10.0KHRCT-ND; Value: 10k
R51 R55 = RES 20K 0603: Tolerance: 1%; Power: 0.1W; Footprint: 0603; Value: 20K; Digikey Part Number: 311-20.0KHRCT-ND
R57 R72 = RES 100R 0603: Tolerance: 1%; Power: 0.25W; Type: RES; Footprint: 0603; Digikey Part Number: 541-100SACT-ND; Value: 100R
R58 R63 = RES 13K 0603: Tolerance: 1%; Type: RES; Footprint: 0603; Value: 13k; Digikey Part Number: 311-13.0KHRCT-ND
R59 R60 = RES 9K 0603: Tolerance: 1%; Type: RES; Footprint: 0603; Value: 9K; Digikey Part Number: 311-9.09KHRCT-ND
R64 R67 = RES 35K 0603: Tolerance: 1%; Type: RES; Footprint: 0603; Value: 35K; Digikey Part Number: 311-34.8KHRCT-ND
R70 = RES 30K 0603: Tolerance: 1%; Type: RES; Footprint: 0603; Value: 30K; Digikey Part Number: 311-30.0KHRCT-ND
R71 = RES 15K 0603: Tolerance: 1%; Type: RES; Footprint: 0603; Value: 15K; Digikey Part Number: 311-15.0KHRCT-ND
U7 = OPA4134UA: Quad OPAx134 Operational Amplifier; Digikey Part Number: 296-26284-1-ND
U8 = OPA2134UA/2K5: Digikey Part Number: 296-22024-1-ND

## Sheet Connectors.SchDoc
size A4; DocumentNumber: 6; SheetNumber: 6; SheetTotal: 6
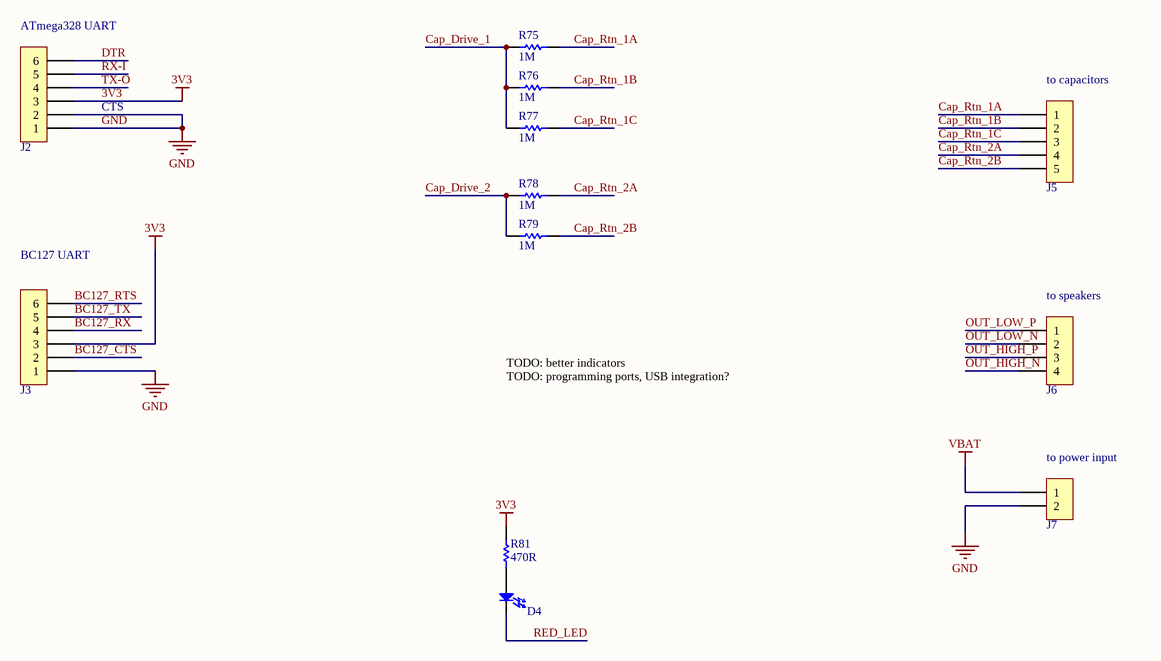
[diagram p5: Connectors.SchDoc]

### Parts
D4  LED 0603  [DIOM1608X08N]  (value not drawn)
J2  6POS THRU HOLE 2.54MM  [90147-1106]  (value not drawn)
J3  6POS THRU HOLE 2.54MM  [90147-1106]  (value not drawn)
J5  5POS THRU HOLE 2.54MM  [70543-0004]  (value not drawn)
J6  TERMINAL BLOCK 4POS  [TERMINAL BLOCK 5MM 4POS]  (value not drawn)
J7  TERMINAL BLOCK 2POS  [TERMINAL BLOCK 5MM 2POS]  (value not drawn)
R75  1M  [RESC1608X06N]
R76  1M  [RESC1608X06N]
R77  1M  [RESC1608X06N]
R78  1M  [RESC1608X06N]
R79  1M  [RESC1608X06N]
R81  470R  [RESC1608X06N]

### Nets
3V3: J2.3 J3.3 R81.2
GND: J2.1 J2.2 J3.1 J7.2
VBAT: J7.1
BC127_CTS: J3.2
BC127_RTS: J3.6
BC127_RX: J3.4
BC127_TX: J3.5
Cap_Drive_1: R75.1 R76.1 R77.1
Cap_Drive_2: R78.1 R79.1
Cap_Rtn_1A: J5.1 R75.2
Cap_Rtn_1B: J5.2 R76.2
Cap_Rtn_1C: J5.3 R77.2
Cap_Rtn_2A: J5.4 R78.2
Cap_Rtn_2B: J5.5 R79.2
DTR: J2.6
OUT_HIGH_N: J6.4
OUT_HIGH_P: J6.3
OUT_LOW_N: J6.2
OUT_LOW_P: J6.1
RED_LED: D4.1(K2)
RX-I: J2.5
TX-O: J2.4
NetD4_2: D4.2(A2) R81.1

### Notes on the sheet
- (near J2) ATmega328 UART
- CTS
- (near J5) to capacitors
- (near J3) BC127 UART
- (near J6) to speakers
- TODO: better indicators
- TODO: programming ports, USB integration?
- (near J7) to power input

### Library data of the parts
D4 = LED 0603: Voltage: 2.2V; Configuration: Single; Current: 20mA; Footprint: 0603; Temperature: 85dC; Digikey Part Number: 160-1447-1-ND
R75-R79 = RES 1M 0603: Tolerance: 1%; Power: 0.1W; Footprint: 0603; Value: 1M; Digikey Part Number: 311-1.00MHRCT-ND
R81 = RES 470R 0603: Tolerance: 1%; Power: 0.25W; Type: RES; Footprint: 0603; Value: 470R; Digikey Part Number: 311-470HRCT-ND
J6 = TERMINAL BLOCK 4POS: Digikey Part Number: ED2563-ND
J7 = TERMINAL BLOCK 2POS: Digikey Part Number: ED2561-ND

## Nets that join several sheets
3V3: Power_Supply (C9.2 U3.3), ICs (9 pins), Connectors (J2.3 J3.3 R81.2)
GND: Power_Supply (20 pins), ICs (21 pins), Input_Section (9 pins), Power_Section (35 pins), Filter_Section (18 pins), Connectors (J2.1 J2.2 J3.1 J7.2)
VBAT: Power_Supply (8 pins), Connectors (J7.1)
VSUPPLY: Power_Supply (5 pins), Input_Section (5 pins), Power_Section (14 pins), Filter_Section (7 pins)
BC127_CTS: ICs (U2.40), Connectors (J3.2)
BC127_LN: ICs (U2.13), Input_Section (R15.1)
BC127_LP: ICs (U2.14), Input_Section (R12.1)
BC127_RN: ICs (U2.15), Input_Section (R16.1)
BC127_RP: ICs (U2.16), Input_Section (R13.1)
BC127_RTS: ICs (U2.43), Connectors (J3.6)
BC127_RX: ICs (U2.42), Connectors (J3.4)
BC127_TX: ICs (U2.41), Connectors (J3.5)
Buffered_High: Power_Section (U6.10), Filter_Section (C62.2)
Buffered_Low: Power_Section (U6.4), Filter_Section (C61.2)
Cap_Drive_1: ICs (U1.9), Connectors (R75.1 R76.1 R77.1)
Cap_Drive_2: ICs (U1.16), Connectors (R78.1 R79.1)
Cap_Rtn_1A: ICs (U1.11), Connectors (J5.1 R75.2)
Cap_Rtn_1B: ICs (U1.12), Connectors (J5.2 R76.2)
Cap_Rtn_1C: ICs (U1.10), Connectors (J5.3 R77.2)
Cap_Rtn_2A: ICs (U1.15), Connectors (J5.4 R78.2)
Cap_Rtn_2B: ICs (U1.14), Connectors (J5.5 R79.2)
Crossover_In: Input_Section (S1.1), Filter_Section (C45.1 R49.1)
DTR: ICs (C1.1), Connectors (J2.6)
Mute: ICs (U1.25), Power_Section (R37.2 U6.12)
OUT_HIGH_N: Power_Section (C40.1 L5.2 R48.1), Connectors (J6.4)
OUT_HIGH_P: Power_Section (C39.2 L4.2 R47.2), Connectors (J6.3)
OUT_LOW_N: Power_Section (C38.1 L3.2 R46.1), Connectors (J6.2)
OUT_LOW_P: Power_Section (C37.2 L2.2 R45.2), Connectors (J6.1)
RED_LED: ICs (U2.37), Connectors (D4.1)
RX-I: ICs (U1.31), Connectors (J2.5)
TX-O: ICs (U1.30), Connectors (J2.4)